# Altium schematic sheet Current_Sensor.SchDoc
size A3; SheetNumber: 2; SheetTotal: 4
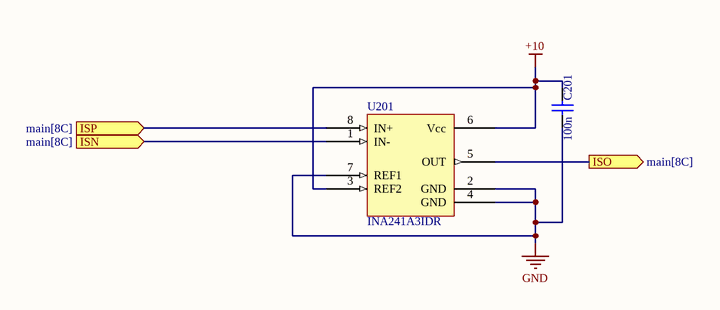
[diagram p0: Current_Sensor.SchDoc]

## Parts
C201  100n  [CAP_1206]
U201  INA241A3IDR  [SOIC8_M]

## Ports
ISN (in, see main[8C]), ISO (out, see main[8C]), ISP (in, see main[8C])

## Nets
+10: C201.2 U201.3(REF2) U201.6(Vcc)
GND: C201.1 U201.2(GND) U201.4(GND) U201.7(REF1)
ISN: U201.1(IN-) ; port ISN
ISO: U201.5(OUT) ; port ISO
ISP: U201.8(IN+) ; port ISP

## Library data of the parts
C201 = CAPN 1206: Non Polarized Capacitor, SMD, 1206
U201 = INA241A3IDR: Current Sense Amp